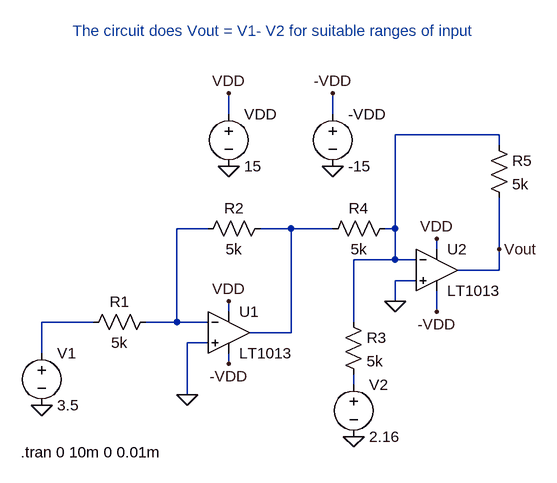
[diagram p0: schematic Subtractor_Circuit.asc]
Subtractor_Circuit.asc, the LTspice schematic file:
Version 4.1
SHEET 1 1228 680
WIRE 288 -240 288 -272
WIRE 448 -240 448 -272
WIRE 704 -208 544 -208
WIRE 704 -192 704 -208
WIRE 256 -64 208 -64
WIRE 384 -64 336 -64
WIRE 448 -64 384 -64
WIRE 544 -64 544 -208
WIRE 544 -64 528 -64
WIRE 608 -32 608 -48
WIRE 704 -32 704 -112
WIRE 544 -16 544 -64
WIRE 544 -16 480 -16
WIRE 576 -16 544 -16
WIRE 704 0 704 -32
WIRE 704 0 640 0
WIRE 576 16 544 16
WIRE 544 48 544 16
WIRE 288 64 288 48
WIRE 608 64 608 32
WIRE 80 80 0 80
WIRE 208 80 208 -64
WIRE 208 80 160 80
WIRE 256 80 208 80
WIRE 480 80 480 -16
WIRE 384 96 384 -64
WIRE 384 96 320 96
WIRE 256 112 224 112
WIRE 0 128 0 80
WIRE 288 144 288 128
WIRE 480 176 480 160
WIRE 224 192 224 112
FLAG 0 208 0
FLAG 224 192 0
FLAG 288 -160 0
FLAG 448 -160 0
FLAG 448 -272 -VDD
FLAG 288 -272 VDD
FLAG 288 48 VDD
FLAG 288 144 -VDD
FLAG 480 256 0
FLAG 608 -48 VDD
FLAG 608 64 -VDD
FLAG 544 48 0
FLAG 704 -32 Vout
SYMBOL voltage 0 112 R0
WINDOW 123 0 0 Left 0
WINDOW 39 0 0 Left 0
SYMATTR InstName V1
SYMATTR Value 3.5
SYMBOL res 176 64 R90
WINDOW 0 0 56 VBottom 2
WINDOW 3 32 56 VTop 2
SYMATTR InstName R1
SYMATTR Value 5k
SYMBOL OpAmps\\LT1013 288 32 R0
SYMATTR InstName U1
SYMBOL voltage 288 -256 R0
SYMATTR InstName VDD
SYMATTR Value 15
SYMBOL voltage 448 -256 R0
SYMATTR InstName -VDD
SYMATTR Value -15
SYMBOL res 352 -80 R90
WINDOW 0 0 56 VBottom 2
WINDOW 3 32 56 VTop 2
SYMATTR InstName R2
SYMATTR Value 5k
SYMBOL voltage 480 160 R0
WINDOW 123 0 0 Left 0
WINDOW 39 0 0 Left 0
SYMATTR InstName V2
SYMATTR Value 2.16
SYMBOL res 464 64 R0
SYMATTR InstName R3
SYMATTR Value 5k
SYMBOL res 544 -80 R90
WINDOW 0 0 56 VBottom 2
WINDOW 3 32 56 VTop 2
SYMATTR InstName R4
SYMATTR Value 5k
SYMBOL OpAmps\\LT1013 608 -64 R0
SYMATTR InstName U2
SYMBOL res 688 -208 R0
SYMATTR InstName R5
SYMATTR Value 5k
TEXT 48 -368 Left 2 ;The circuit does Vout = V1- V2 for suitable ranges of input
TEXT -32 280 Left 2 !.tran 0 10m 0 0.01m

The netlist it stands for:
* Subtractor_Circuit.asc
V1 N004 0 3.5
R1 N002 N004 5k
X§U1 0 N002 VDD -VDD N003 LT1013  ; pins In+ In- V+ V- OUT
VDD VDD 0 15
V§-VDD -VDD 0 -15
R2 N003 N002 5k
V2 N005 0 2.16
R3 N001 N005 5k
R4 N001 N003 5k
X§U2 0 N001 VDD -VDD Vout LT1013  ; pins In+ In- V+ V- OUT
R5 N001 Vout 5k
* The circuit does Vout = V1- V2 for suitable ranges of input
.tran 0 10m 0 0.01m
.lib LTC.lib
.backanno
.end